# EAGLE design TransientsVCFG (EAGLE 9.6.2)
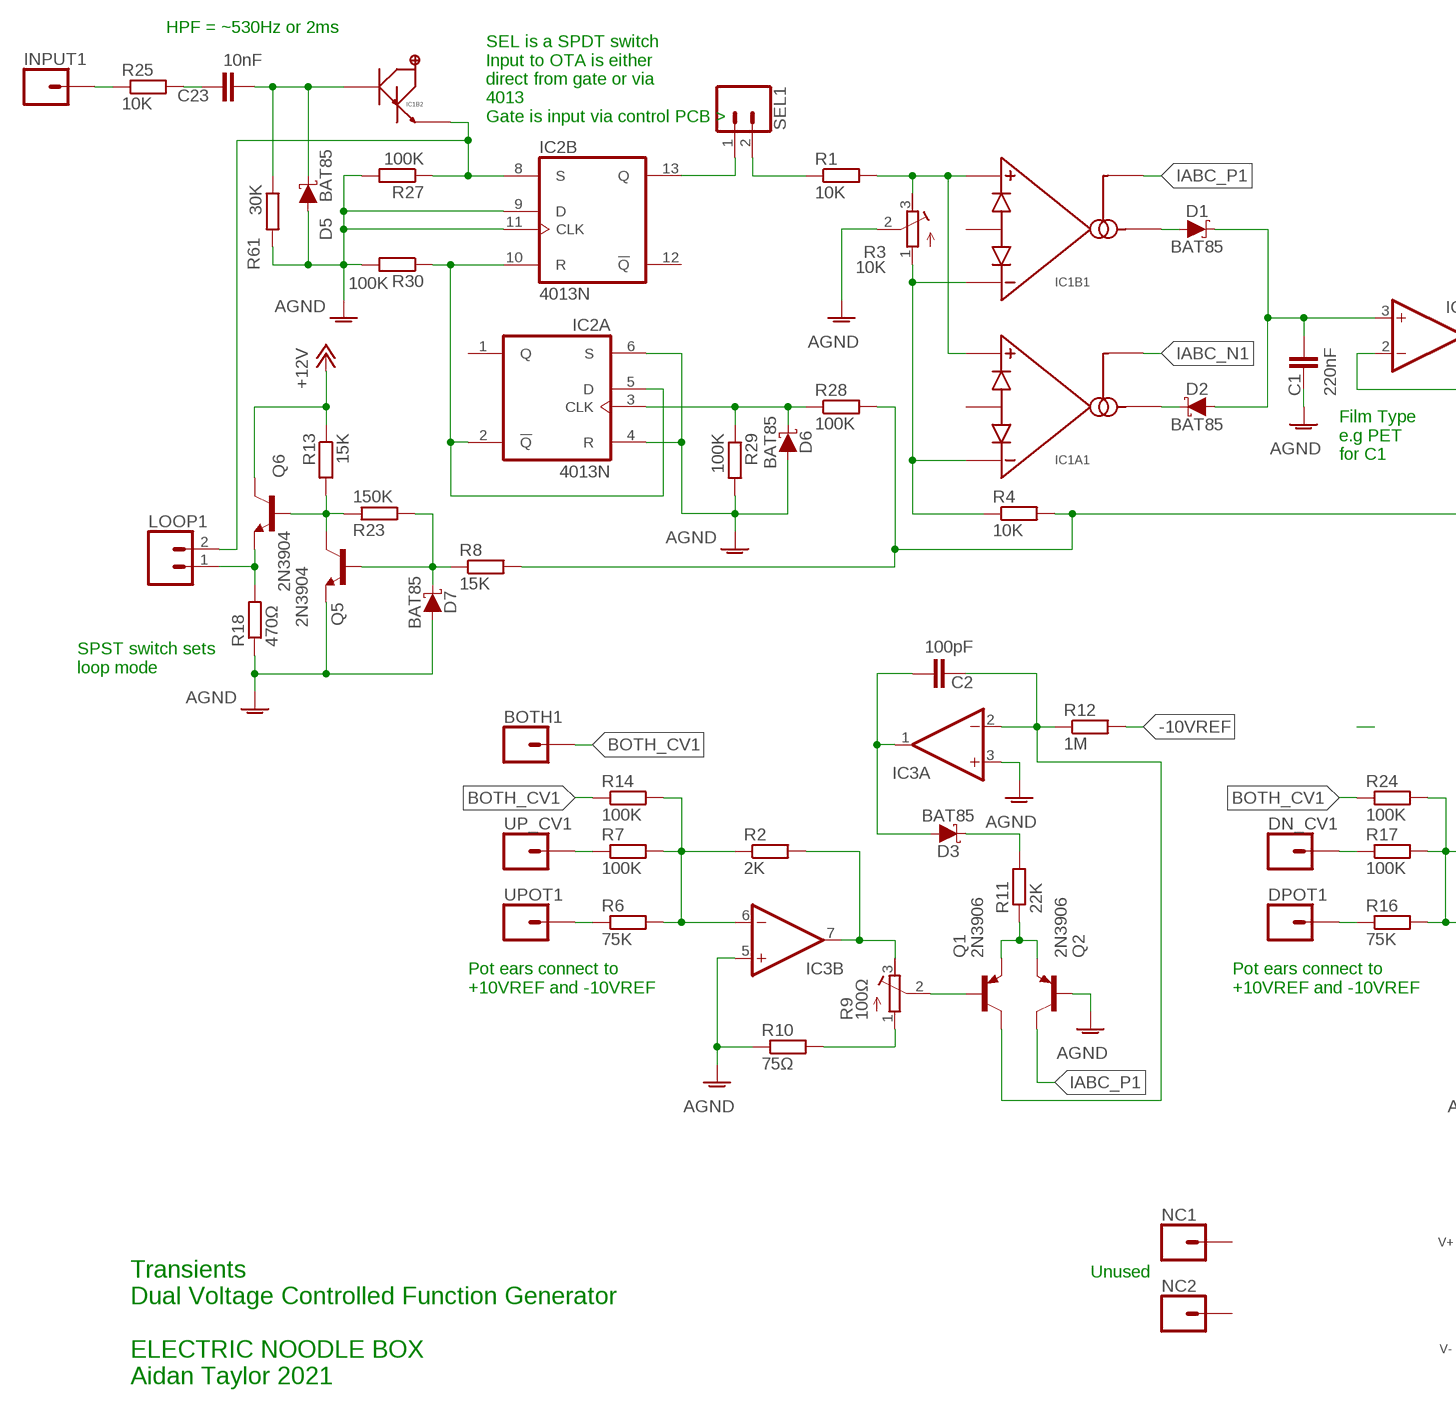
[diagram p0: schematic, sheet 1, part 1 of 2]
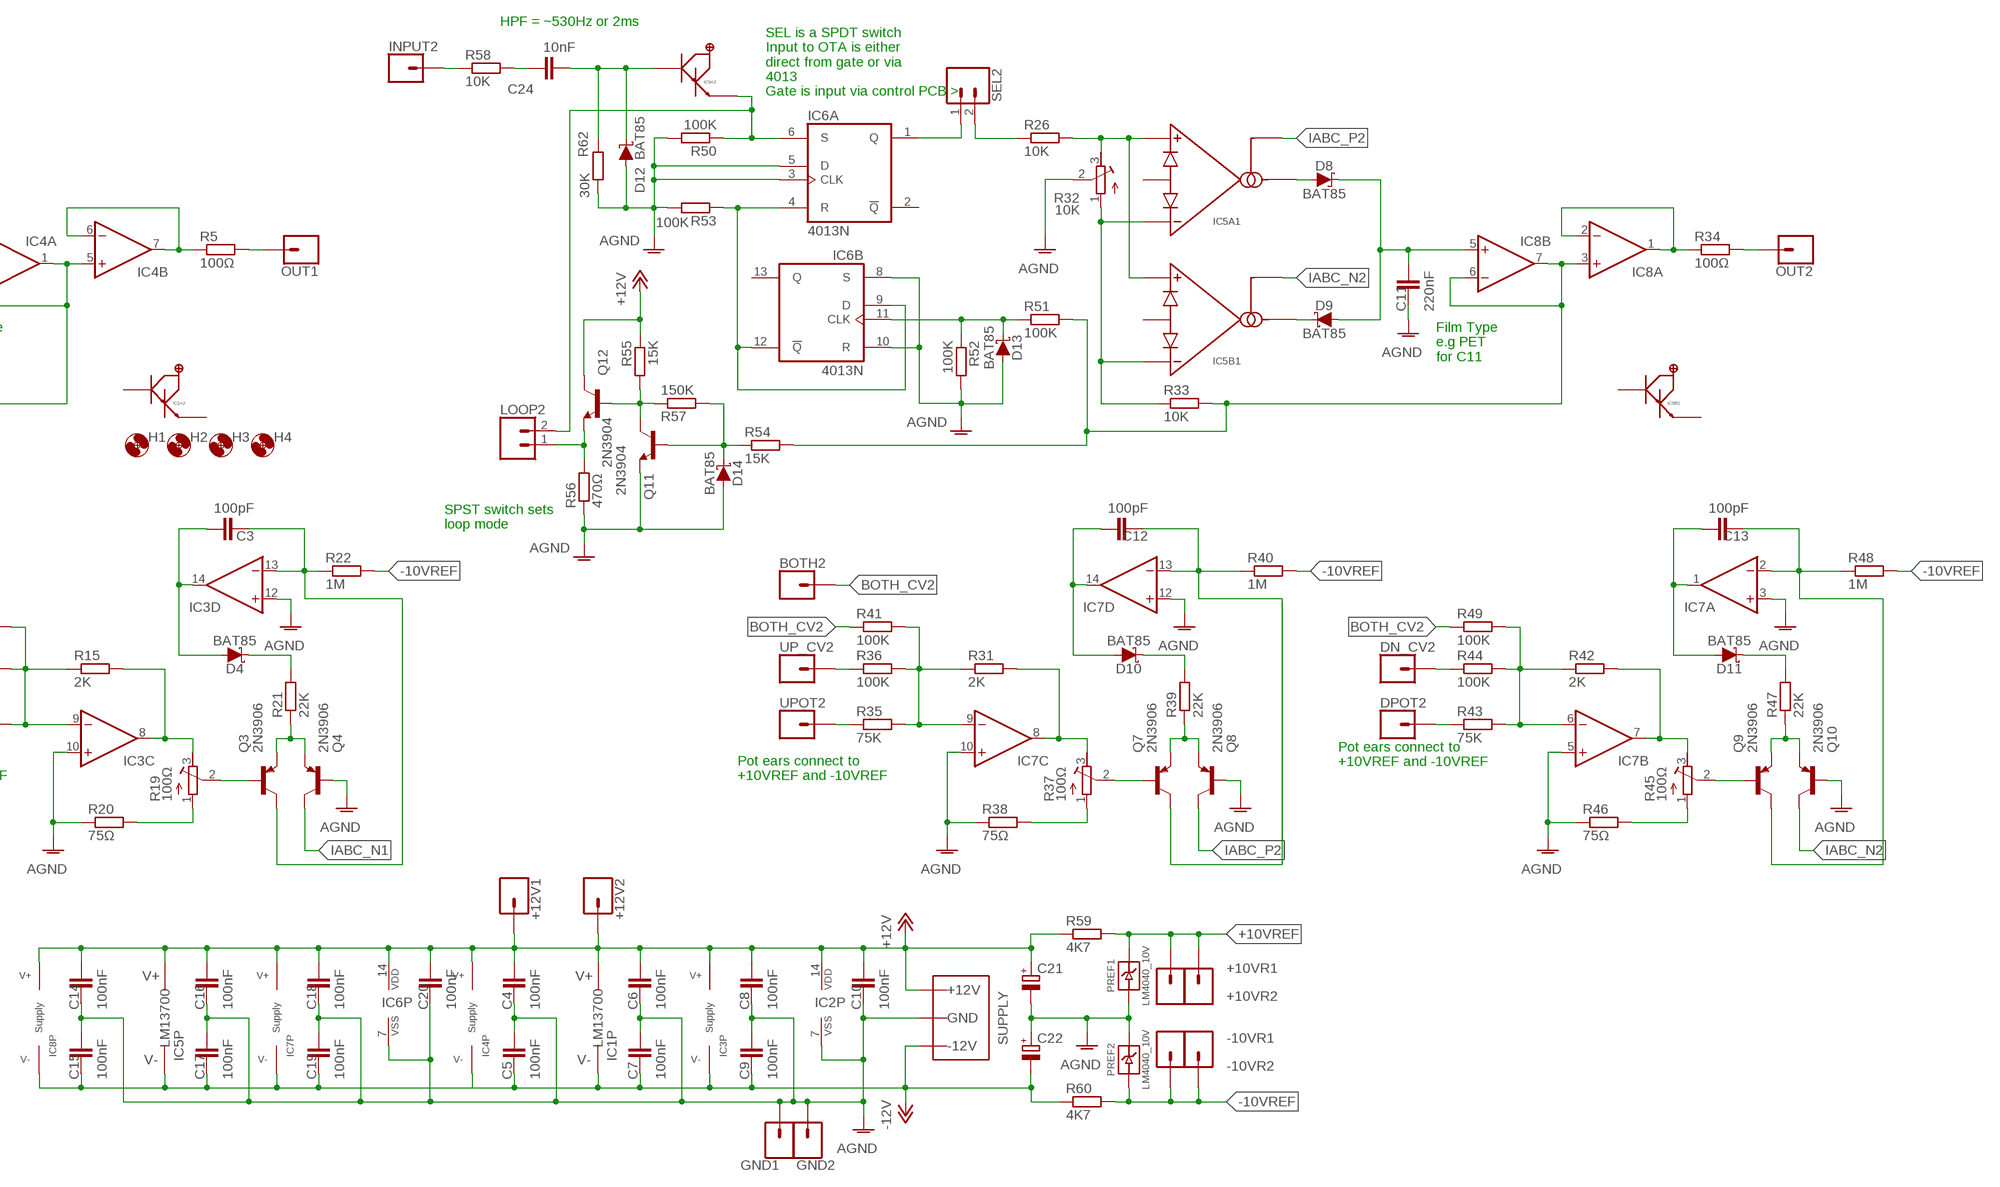
[diagram p1: schematic, sheet 1, part 2 of 2]

## Parts
+10VR1  1XWIREPAD  [1X01]
+10VR2  1XWIREPAD  [1X01]
+12V1  1XWIREPAD  [1X01]
+12V2  1XWIREPAD  [1X01]
-10VR1  1XWIREPAD  [1X01]
-10VR2  1XWIREPAD  [1X01]
BOTH1  1XWIREPAD  [1X01]
BOTH2  1XWIREPAD  [1X01]
C1  220nF  C-EU050-025X075  [C050-025X075]
C2  100pF  C-EU050-025X075  [C050-025X075]
C3  100pF  C-EU050-025X075  [C050-025X075]
C4  100nF  C-EU050-025X075  [C050-025X075]
C5  100nF  C-EU050-025X075  [C050-025X075]
C6  100nF  C-EU050-025X075  [C050-025X075]
C7  100nF  C-EU050-025X075  [C050-025X075]
C8  100nF  C-EU050-025X075  [C050-025X075]
C9  100nF  C-EU050-025X075  [C050-025X075]
C10  100nF  C-EU050-025X075  [C050-025X075]
C11  220nF  C-EU050-025X075  [C050-025X075]
C12  100pF  C-EU050-025X075  [C050-025X075]
C13  100pF  C-EU050-025X075  [C050-025X075]
C14  100nF  C-EU050-025X075  [C050-025X075]
C15  100nF  C-EU050-025X075  [C050-025X075]
C16  100nF  C-EU050-025X075  [C050-025X075]
C17  100nF  C-EU050-025X075  [C050-025X075]
C18  100nF  C-EU050-025X075  [C050-025X075]
C19  100nF  C-EU050-025X075  [C050-025X075]
C20  100nF  C-EU050-025X075  [C050-025X075]
C21  CPOL-EUE2.5-6  [E2,5-6]
C22  CPOL-EUE2.5-6  [E2,5-6]
C23  10nF  C-EU050-025X075  [C050-025X075]
C24  10nF  C-EU050-025X075  [C050-025X075]
D1  BAT85  SCHOTTKY_DO35  [DO35-7]
D2  BAT85  SCHOTTKY_DO35  [DO35-7]
D3  BAT85  SCHOTTKY_DO35  [DO35-7]
D4  BAT85  SCHOTTKY_DO35  [DO35-7]
D5  BAT85  SCHOTTKY_DO35  [DO35-7]
D6  BAT85  SCHOTTKY_DO35  [DO35-7]
D7  BAT85  SCHOTTKY_DO35  [DO35-7]
D8  BAT85  SCHOTTKY_DO35  [DO35-7]
D9  BAT85  SCHOTTKY_DO35  [DO35-7]
D10  BAT85  SCHOTTKY_DO35  [DO35-7]
D11  BAT85  SCHOTTKY_DO35  [DO35-7]
D12  BAT85  SCHOTTKY_DO35  [DO35-7]
D13  BAT85  SCHOTTKY_DO35  [DO35-7]
D14  BAT85  SCHOTTKY_DO35  [DO35-7]
DN_CV1  1XWIREPAD  [1X01]
DN_CV2  1XWIREPAD  [1X01]
DPOT1  1XWIREPAD  [1X01]
DPOT2  1XWIREPAD  [1X01]
GND1  1XWIREPAD  [1X01]
GND2  1XWIREPAD  [1X01]
H1  MOUNT-HOLE3.2  [3,2]
H2  MOUNT-HOLE3.2  [3,2]
H3  MOUNT-HOLE3.2  [3,2]
H4  MOUNT-HOLE3.2  [3,2]
IC1  LM13700DIL  [DIL16]
IC2  4013N  [DIL14]
IC3  TL0X4DIL  [DIL14]
IC4  TL0X2DIL  [DIL08]
IC5  LM13700DIL  [DIL16]
IC6  4013N  [DIL14]
IC7  TL0X4DIL  [DIL14]
IC8  TL0X2DIL  [DIL08]
INPUT1  1XWIREPAD  [1X01]
INPUT2  1XWIREPAD  [1X01]
LOOP1  2XWIREPAD  [1X02]
LOOP2  2XWIREPAD  [1X02]
NC1  1XWIREPAD  [1X01]
NC2  1XWIREPAD  [1X01]
OUT1  1XWIREPAD  [1X01]
OUT2  1XWIREPAD  [1X01]
PREF1  LM4040_10V  LM4040TH  [TO92]
PREF2  LM4040_10V  LM4040TH  [TO92]
Q1  2N3906  [TO92]
Q2  2N3906  [TO92]
Q3  2N3906  [TO92]
Q4  2N3906  [TO92]
Q5  2N3904  [TO92]
Q6  2N3904  [TO92]
Q7  2N3906  [TO92]
Q8  2N3906  [TO92]
Q9  2N3906  [TO92]
Q10  2N3906  [TO92]
Q11  2N3904  [TO92]
Q12  2N3904  [TO92]
R1  10K  R-EU_0207/10  [0207/10]
R2  2K  R-EU_0207/10  [0207/10]
R3  10K  R-TRIMM3296W  [RTRIM3296W]
R4  10K  R-EU_0207/10  [0207/10]
R5  100Ω  R-EU_0207/10  [0207/10]
R6  75K  R-EU_0207/10  [0207/10]
R7  100K  R-EU_0207/10  [0207/10]
R8  15K  R-EU_0207/10  [0207/10]
R9  100Ω  R-TRIMM3296W  [RTRIM3296W]
R10  75Ω  R-EU_0207/10  [0207/10]
R11  22K  R-EU_0207/10  [0207/10]
R12  1M  R-EU_0207/10  [0207/10]
R13  15K  R-EU_0207/10  [0207/10]
R14  100K  R-EU_0207/10  [0207/10]
R15  2K  R-EU_0207/10  [0207/10]
R16  75K  R-EU_0207/10  [0207/10]
R17  100K  R-EU_0207/10  [0207/10]
R18  470Ω  R-EU_0207/10  [0207/10]
R19  100Ω  R-TRIMM3296W  [RTRIM3296W]
R20  75Ω  R-EU_0207/10  [0207/10]
R21  22K  R-EU_0207/10  [0207/10]
R22  1M  R-EU_0207/10  [0207/10]
R23  150K  R-EU_0207/10  [0207/10]
R24  100K  R-EU_0207/10  [0207/10]
R25  10K  R-EU_0207/10  [0207/10]
R26  10K  R-EU_0207/10  [0207/10]
R27  100K  R-EU_0207/10  [0207/10]
R28  100K  R-EU_0207/10  [0207/10]
R29  100K  R-EU_0207/10  [0207/10]
R30  100K  R-EU_0207/10  [0207/10]
R31  2K  R-EU_0207/10  [0207/10]
R32  10K  R-TRIMM3296W  [RTRIM3296W]
R33  10K  R-EU_0207/10  [0207/10]
R34  100Ω  R-EU_0207/10  [0207/10]
R35  75K  R-EU_0207/10  [0207/10]
R36  100K  R-EU_0207/10  [0207/10]
R37  100Ω  R-TRIMM3296W  [RTRIM3296W]
R38  75Ω  R-EU_0207/10  [0207/10]
R39  22K  R-EU_0207/10  [0207/10]
R40  1M  R-EU_0207/10  [0207/10]
R41  100K  R-EU_0207/10  [0207/10]
R42  2K  R-EU_0207/10  [0207/10]
R43  75K  R-EU_0207/10  [0207/10]
R44  100K  R-EU_0207/10  [0207/10]
R45  100Ω  R-TRIMM3296W  [RTRIM3296W]
R46  75Ω  R-EU_0207/10  [0207/10]
R47  22K  R-EU_0207/10  [0207/10]
R48  1M  R-EU_0207/10  [0207/10]
R49  100K  R-EU_0207/10  [0207/10]
R50  100K  R-EU_0207/10  [0207/10]
R51  100K  R-EU_0207/10  [0207/10]
R52  100K  R-EU_0207/10  [0207/10]
R53  100K  R-EU_0207/10  [0207/10]
R54  15K  R-EU_0207/10  [0207/10]
R55  15K  R-EU_0207/10  [0207/10]
R56  470Ω  R-EU_0207/10  [0207/10]
R57  150K  R-EU_0207/10  [0207/10]
R58  10K  R-EU_0207/10  [0207/10]
R59  4K7  R-EU_0207/10  [0207/10]
R60  4K7  R-EU_0207/10  [0207/10]
R61  30K  R-EU_0207/10  [0207/10]
R62  30K  R-EU_0207/10  [0207/10]
SEL1  2XWIREPAD  [1X02]
SEL2  2XWIREPAD  [1X02]
UP_CV1  1XWIREPAD  [1X01]
UP_CV2  1XWIREPAD  [1X01]
UPOT1  1XWIREPAD  [1X01]
UPOT2  1XWIREPAD  [1X01]
WP1  COMBO_SUPPLY_HEADER  [COMBINED_POWER]

## Nets
+10VREF: +10VR1.1 +10VR2.1 PREF1.2(CATHODE) R59.2
+12V: +12V1.1 +12V2.1 C4.1 C6.1 C8.1 C10.1 C14.1 C16.1 C18.1 C20.1 C21.+ IC1.11(P:V+) IC2.14(P:VDD) IC3.4(P:V+) IC4.8(P:V+) IC5.11(P:V+) IC6.14(P:VDD) IC7.4(P:V+) IC8.8(P:V+) Q6.1(C) Q12.1(C) R13.1 R55.1 R59.1 WP1.V+1(V++) WP1.V+2(V++) WP1.V+3(V++)
-10VREF: -10VR1.1 -10VR2.1 PREF2.3(ANODE) R12.2 R22.2 R40.2 R48.2 R60.2
-12V: C5.2 C7.2 C9.2 C15.2 C17.2 C19.2 C22.- IC1.6(P:V-) IC3.11(P:V-) IC4.4(P:V-) IC5.6(P:V-) IC7.11(P:V-) IC8.4(P:V-) R60.1 WP1.V-1(V--) WP1.V-2(V--) WP1.V-3(V--)
AGND: C1.2 C4.2 C5.1 C6.2 C7.1 C8.2 C9.1 C10.2 C11.2 C14.2 C15.1 C16.2 C17.1 C18.2 C19.1 C20.2 C21.- C22.+ D5.A D6.A D7.A D12.A D13.A D14.A GND1.1 GND2.1 IC2.4(A:R) IC2.6(A:S) IC2.7(P:VSS) IC2.9(B:D) IC2.11(B:CLK) IC3.3(A:+IN) IC3.5(B:+IN) IC3.10(C:+IN) IC3.12(D:+IN) IC6.3(A:CLK) IC6.5(A:D) IC6.7(P:VSS) IC6.8(B:S) IC6.10(B:R) IC7.3(A:+IN) IC7.5(B:+IN) IC7.10(C:+IN) IC7.12(D:+IN) PREF1.3(ANODE) PREF2.2(CATHODE) Q2.2(B) Q4.2(B) Q5.3(E) Q8.2(B) Q10.2(B) Q11.3(E) R3.2(S) R10.1 R18.1 R20.1 R27.2 R29.2 R30.2 R32.2(S) R38.1 R46.1 R50.2 R52.2 R53.2 R56.1 R61.2 R62.2 WP1.GND1(AGND) WP1.GND2(AGND) WP1.GND3(AGND) WP1.GND4(AGND) WP1.GND5(AGND) WP1.GND6(AGND) WP1.GND7(AGND) WP1.GND8(AGND)
BOTH_CV1: BOTH1.1 R14.1 R24.1
BOTH_CV2: BOTH2.1 R41.1 R49.1
IABC_N1: IC1.1(A1:AMPBIAS) Q4.1(C)
IABC_N2: IC5.16(B1:AMPBIAS) Q10.1(C)
IABC_P1: IC1.16(B1:AMPBIAS) Q2.1(C)
IABC_P2: IC5.1(A1:AMPBIAS) Q8.1(C)
N$1: IC1.3(A1:AMP+) IC1.14(B1:AMP+) R1.2 R3.3(E)
N$2: D1.A IC1.12(B1:AMPOUT)
N$3: C1.1 D1.C D2.A IC4.3(A:+IN)
N$4: IC4.1(A:OUT) IC4.2(A:-IN) IC4.5(B:+IN) R4.2 R8.2 R28.2
N$5: D2.C IC1.5(A1:AMPOUT)
N$6: IC4.6(B:-IN) IC4.7(B:OUT) R5.1
N$7: IC1.4(A1:AMP-) IC1.13(B1:AMP-) R3.1(A) R4.1
N$8: IC3.6(B:-IN) R2.1 R6.2 R7.2 R14.2
N$9: IC3.7(B:OUT) R2.2 R9.3(E)
N$10: R9.1(A) R10.2
N$11: Q1.2(B) R9.2(S)
N$12: Q1.3(E) Q2.3(E) R11.1
N$13: C2.1 D3.A IC3.1(A:OUT)
N$14: C2.2 IC3.2(A:-IN) Q1.1(C) R12.1
N$15: D3.C R11.2
N$16: IC5.3(A1:AMP+) IC5.14(B1:AMP+) R26.2 R32.3(E)
N$17: C11.1 D8.C D9.A IC8.5(B:+IN)
N$18: R7.1 UP_CV1.1
N$19: OUT1.1 R5.2
N$20: IC3.9(C:-IN) R15.1 R16.2 R17.2 R24.2
N$21: R6.1 UPOT1.1
N$22: IC3.8(C:OUT) R15.2 R19.3(E)
N$23: R19.1(A) R20.2
N$24: Q3.2(B) R19.2(S)
N$25: Q3.3(E) Q4.3(E) R21.1
N$26: C3.1 D4.A IC3.14(D:OUT)
N$27: C3.2 IC3.13(D:-IN) Q3.1(C) R22.1
N$28: IC1.9(B2:BUFF_OUT) IC2.8(B:S) LOOP1.2 R27.1
N$29: D4.C R21.2
N$30: Q5.1(C) Q6.2(B) R13.2 R23.1
N$31: DN_CV1.1 R17.1
N$32: DPOT1.1 R16.1
N$33: R1.1 SEL1.2
N$34: IC2.13(B:Q) SEL1.1
N$35: IC8.3(A:+IN) IC8.6(B:-IN) IC8.7(B:OUT) R33.2 R51.2 R54.2
N$36: INPUT1.1 R25.1
N$37: IC2.2(A:!Q) IC2.5(A:D) IC2.10(B:R) R30.1
N$38: LOOP1.1 Q6.3(E) R18.2
N$39: D7.C Q5.2(B) R8.1 R23.2
N$40: C23.2 D5.C IC1.10(B2:BUFF_IN) R61.1
N$41: D6.C IC2.3(A:CLK) R28.1 R29.1
N$43: D8.A IC5.5(A1:AMPOUT)
N$44: D9.C IC5.12(B1:AMPOUT)
N$45: IC5.4(A1:AMP-) IC5.13(B1:AMP-) R32.1(A) R33.1
N$46: IC8.1(A:OUT) IC8.2(A:-IN) R34.1
N$47: IC7.9(C:-IN) R31.1 R35.2 R36.2 R41.2
N$48: IC7.8(C:OUT) R31.2 R37.3(E)
N$49: R37.1(A) R38.2
N$50: Q7.2(B) R37.2(S)
N$51: Q7.3(E) Q8.3(E) R39.1
N$52: C12.1 D10.A IC7.14(D:OUT)
N$53: C12.2 IC7.13(D:-IN) Q7.1(C) R40.1
N$54: R36.1 UP_CV2.1
N$55: R35.1 UPOT2.1
N$56: OUT2.1 R34.2
N$57: IC7.6(B:-IN) R42.1 R43.2 R44.2 R49.2
N$58: IC7.7(B:OUT) R42.2 R45.3(E)
N$59: R45.1(A) R46.2
N$60: Q9.2(B) R45.2(S)
N$61: Q9.3(E) Q10.3(E) R47.1
N$62: C13.1 D11.A IC7.1(A:OUT)
N$63: C13.2 IC7.2(A:-IN) Q9.1(C) R48.1
N$64: DN_CV2.1 R44.1
N$65: DPOT2.1 R43.1
N$66: IC6.4(A:R) IC6.9(B:D) IC6.12(B:!Q) R53.1
N$67: IC5.8(A2:BUFF_OUT) IC6.6(A:S) LOOP2.2 R50.1
N$68: R26.1 SEL2.2
N$69: IC6.1(A:Q) SEL2.1
N$70: D13.C IC6.11(B:CLK) R51.1 R52.1
N$71: C24.1 R58.2
N$72: D11.C R47.2
N$73: D10.C R39.2
N$74: Q11.1(C) Q12.2(B) R55.2 R57.1
N$75: LOOP2.1 Q12.3(E) R56.2
N$76: D14.C Q11.2(B) R54.1 R57.2
N$77: INPUT2.1 R58.1
N$79: C23.1 R25.2
N$80: C24.2 D12.C IC5.7(A2:BUFF_IN) R62.1
Unconnected: IC1.2(A1:DIODES) IC1.7(A2:BUFF_IN) IC1.8(A2:BUFF_OUT) IC1.15(B1:DIODES) IC2.1(A:Q) IC2.12(B:!Q) IC5.2(A1:DIODES) IC5.9(B2:BUFF_OUT) IC5.10(B2:BUFF_IN) IC5.15(B1:DIODES) IC6.2(A:!Q) IC6.13(B:Q) NC1.1 NC2.1

## Notes on the sheet
- HPF = ~530Hz or 2ms | HPF = ~530Hz or 2ms
- SEL is a SPDT switch
  Input to OTA is either 
  direct from gate or via
  4013
  Gate is input via control PCB >
- SEL is a SPDT switch
  Input to OTA is either 
  direct from gate or via
  4013
  Gate is input via control PCB >
- Film Type
  e.g PET
  for C1
- Film Type
  e.g PET
  for C11
- SPST switch sets
  loop mode
- SPST switch sets
  loop mode
- Pot ears connect to
  +10VREF and -10VREF
- Pot ears connect to
  +10VREF and -10VREF
- Pot ears connect to
  +10VREF and -10VREF
- Pot ears connect to
  +10VREF and -10VREF
- Unused
- Transients
  Dual Voltage Controlled Function Generator
  
  ELECTRIC NOODLE BOX
  Aidan Taylor 2021

## Library data of the parts
+10VR1 +10VR2 +12V1 +12V2 -10VR1 -10VR2 BOTH1 BOTH2 DN_CV1 DN_CV2 DPOT1 DPOT2 GND1 GND2 INPUT1 INPUT2 NC1 NC2 OUT1 OUT2 UP_CV1 UP_CV2 UPOT1 UPOT2 = ElectricNoodleBox:1XWIREPAD
C1-C20 C23 C24 = rcl:C-EU: CAPACITOR, European symbol; SPICEPREFIX: C
C21 C22 = rcl:CPOL-EU: POLARIZED CAPACITOR, European symbol; SPICEPREFIX: C
D1-D14 = ElectricNoodleBox:SCHOTTKY_DO35
H1-H4 = holes:MOUNT-HOLE: MOUNTING HOLE with drill center marker
IC1 IC5 = ElectricNoodleBox:LM13700: Dual Transconductance Amplifier with Darlington Buffer; CATALOGUE: 3118206; RETAILER: Farnell
IC2 IC6 = 40xx:4013: Dual D FLIP FLOP, set/reset
IC3 IC7 = ElectricNoodleBox:TL0X4: Quad Operational Amplifier; CATALOGUE: 3005140; RETAILER: Farnell
IC4 IC8 = ElectricNoodleBox:TL0X2: Dual Operational Amplifier; CATALOGUE: 1103189; RETAILER: Farnell
LOOP1 LOOP2 SEL1 SEL2 = ElectricNoodleBox:2XWIREPAD
PREF1 PREF2 = ElectricNoodleBox:LM4040
Q1-Q4 Q7-Q10 = transistor-pnp:2N3906: PNP Transistor
Q5 Q6 Q11 Q12 = transistor-npn:2N3904: NPN Transistor
R1 R2 R4-R8 R10-R18 R20-R31 R33-R36 R38-R44 R46-R62 = rcl:R-EU_: RESISTOR, European symbol; SPICEPREFIX: R
R3 R9 R19 R32 R37 R45 = rcl:R-TRIMM: Trimm resistor; SPICEMODEL: X; SPICEPREFIXL: POT
WP1 = ElectricNoodleBox:COMBO_SUPPLY_HEADER

## Board
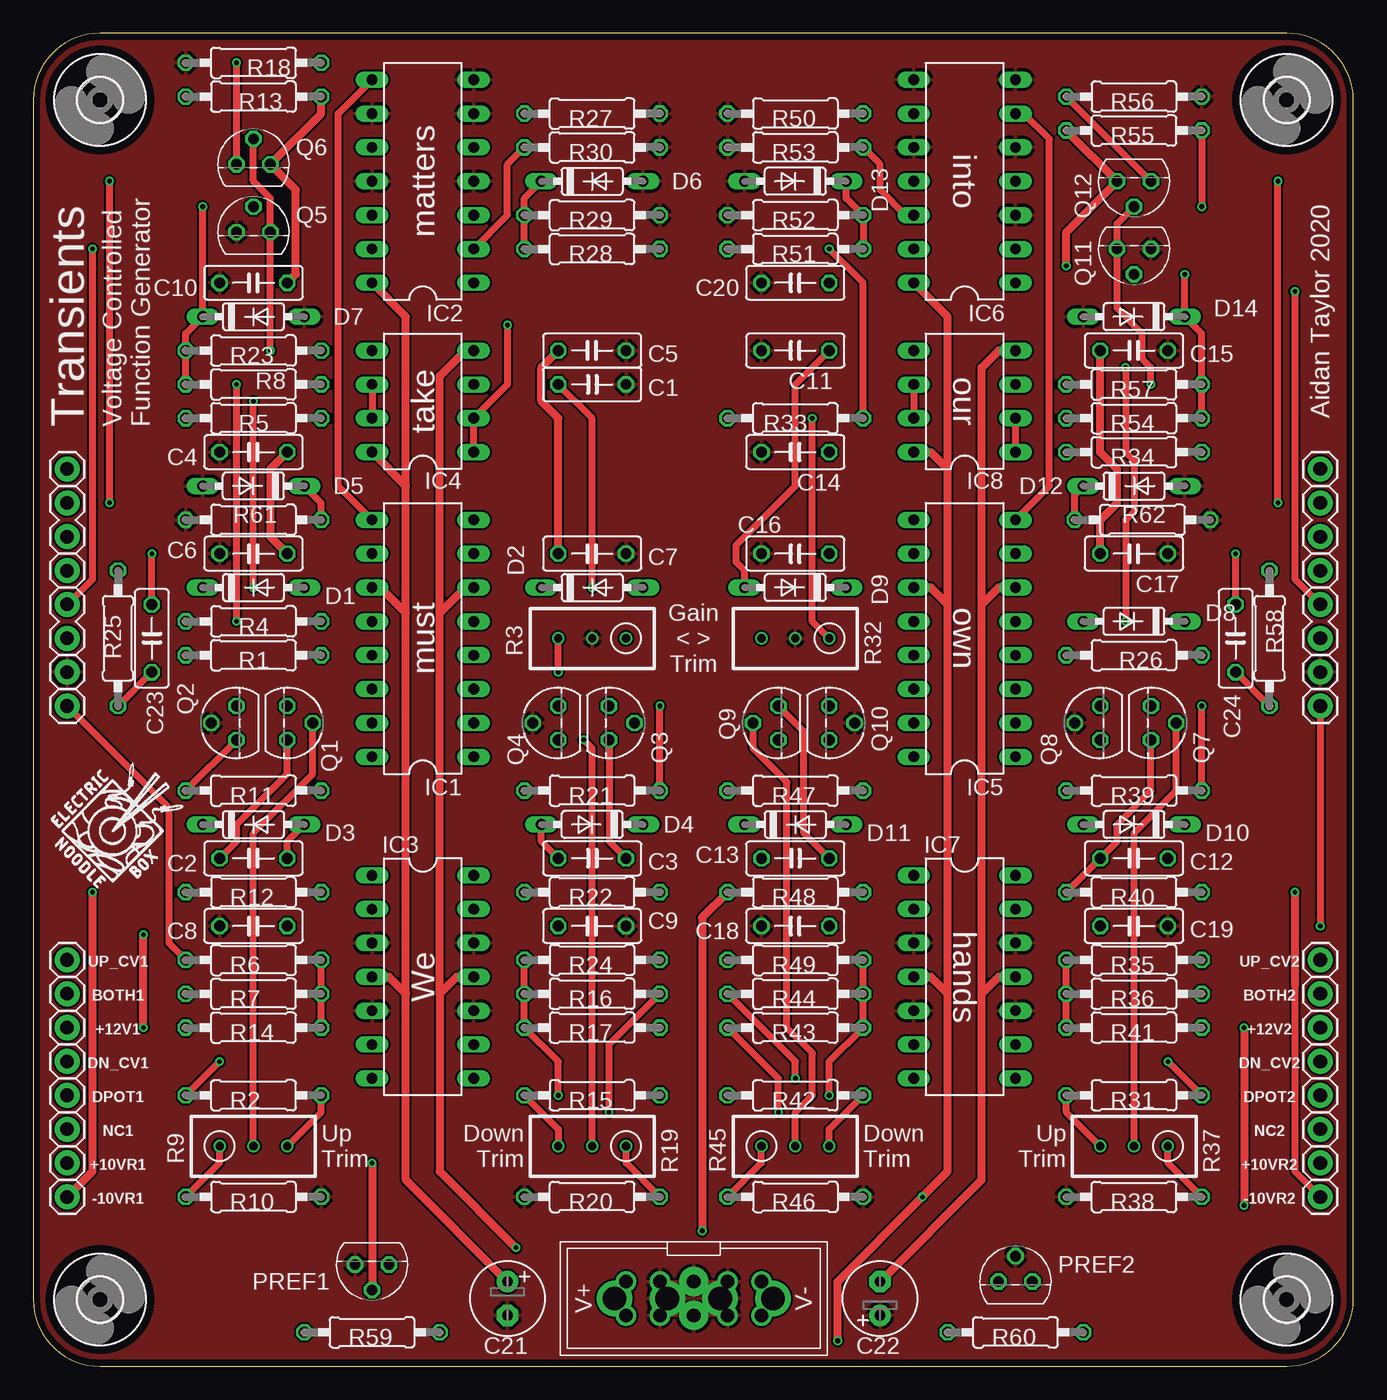
[diagram p2: board, top side]
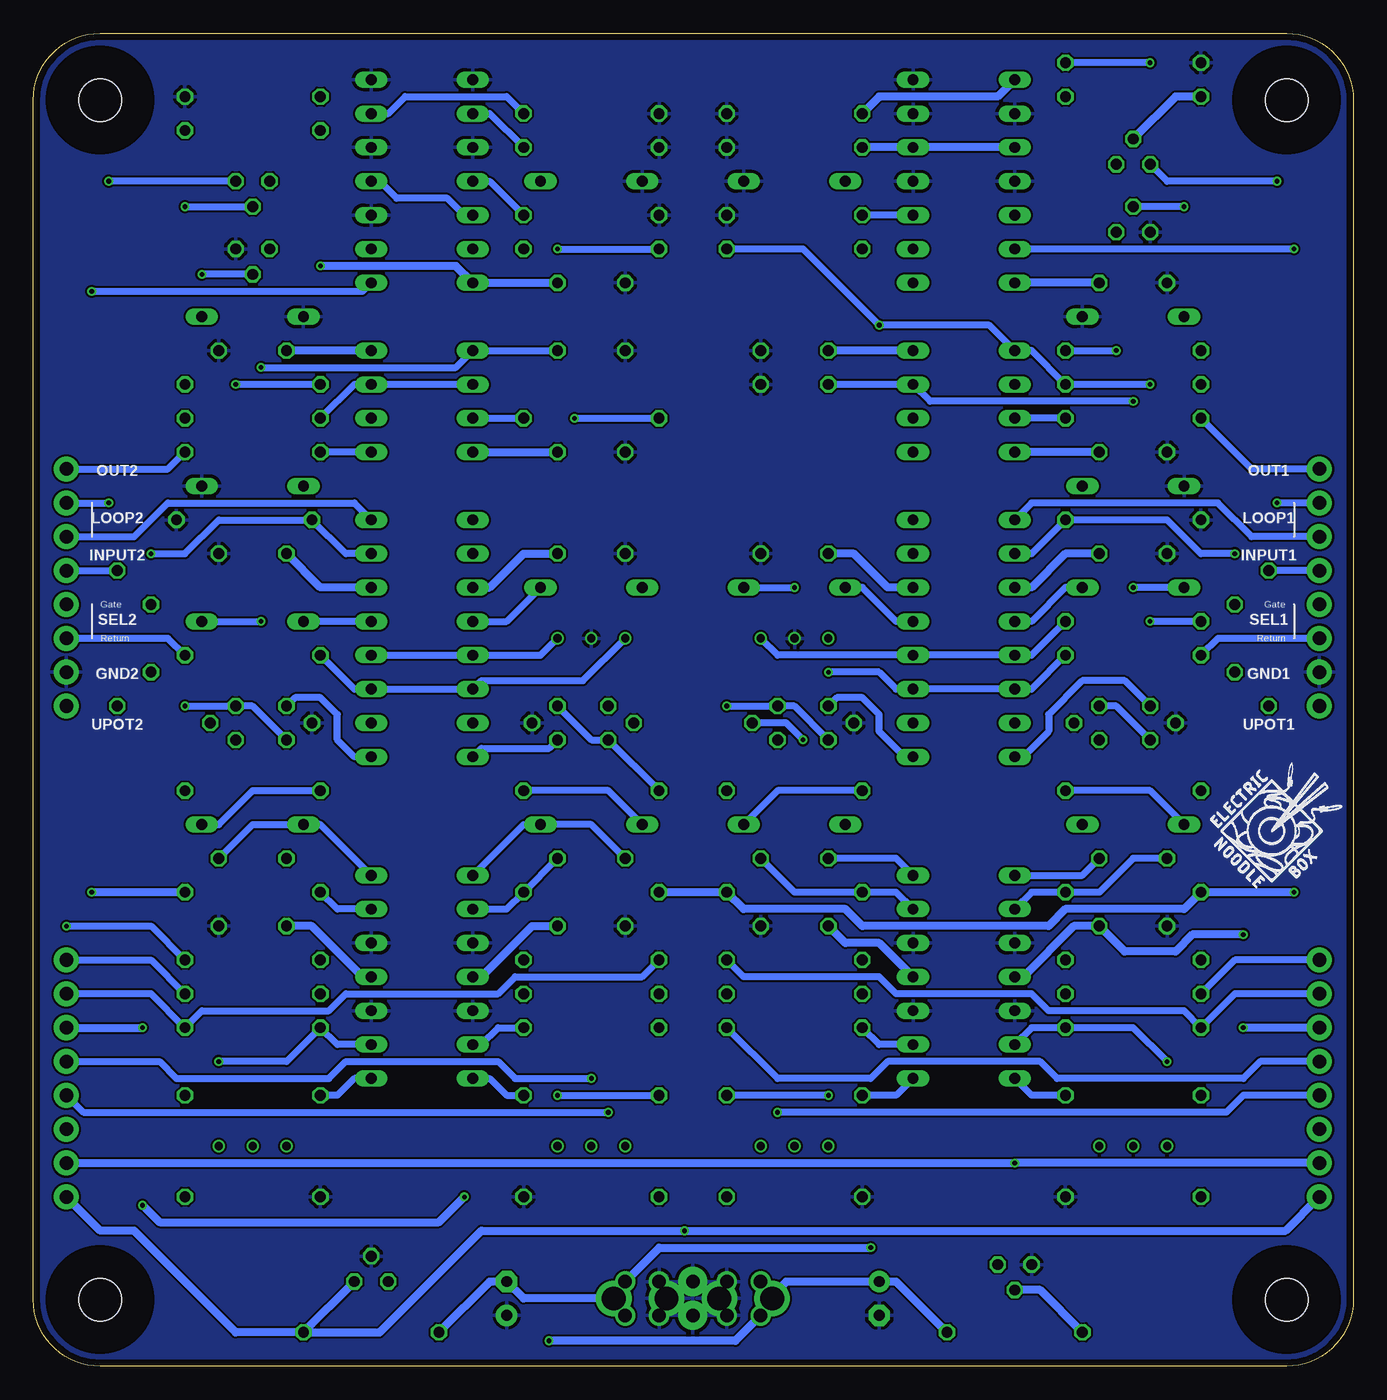
[diagram p3: board, bottom side, seen from below]

Size 99 x 100 mm. Coordinates in mm from the lower left corner, seen from the top.
Outline: 0,95 0,5 arc90 5,0 94,0 arc90 99,5 99,95 arc90 94,100 5,100 arc90 0,95
Copper layers (1*16): Top 0.035mm / dielectric 1.6mm / Bottom 0.035mm
Design rules "Elecrow_2-layer_PCB_eagle_rule": minimum track width 6mil, minimum drill 12mil, track to track 6mil, track to pad 6mil, pad to pad 6mil, via to via 8mil, smd to smd 0mil, copper to edge 20mil, drill to drill 10mil, minimum pad ring 6mil, minimum via ring 6mil, stop-mask expansion 0mil, vias tented up to drill 100mil, thermal gap 10mil

### Footprints (pad centres in the part's own frame; a part is rotated, then mirrored left to right if it is on the bottom)
1X01 = drill 1.016 pad 1.88: 1 0,0
C050-025X075 = drill 0.813 octagon: 1 -2.54,0; 2 2.54,0
E2,5-6 = drill 0.813 pad 1.6: + -1.27,0 | drill 0.813 pad 1.6 octagon: - 1.27,0
DO35-7 = drill 0.813 long: A 3.81,0; C -3.81,0
3,2 = hole 3.2: 0,0
DIL16 = drill 0.813 long: 1 -8.89,-3.81; 2 -6.35,-3.81; 3 -3.81,-3.81; 4 -1.27,-3.81; 5 1.27,-3.81; 6 3.81,-3.81; 7 6.35,-3.81; 8 8.89,-3.81; 9 8.89,3.81; 10 6.35,3.81; 11 3.81,3.81; 12 1.27,3.81; 13 -1.27,3.81; 14 -3.81,3.81; 15 -6.35,3.81; 16 -8.89,3.81
DIL14 = drill 0.813 long: 1 -7.62,-3.81; 2 -5.08,-3.81; 3 -2.54,-3.81; 4 0,-3.81; 5 2.54,-3.81; 6 5.08,-3.81; 7 7.62,-3.81; 8 7.62,3.81; 9 5.08,3.81; 10 2.54,3.81; 11 0,3.81; 12 -2.54,3.81; 13 -5.08,3.81; 14 -7.62,3.81
DIL08 = drill 0.813 long: 1 -3.81,-3.81; 2 -1.27,-3.81; 3 1.27,-3.81; 4 3.81,-3.81; 5 3.81,3.81; 6 1.27,3.81; 7 -1.27,3.81; 8 -3.81,3.81
1X02 = drill 1.016 pad 1.88: 1 0,0; 2 2.54,0
TO92 = drill 0.813 octagon: 1 -1.27,0; 2 0,1.905; 3 1.27,0
TO92' = drill 0.813 octagon: 1 1.27,0; 2 0,1.905; 3 -1.27,0
0207/10 = drill 0.813 octagon: 1 -5.08,0; 2 5.08,0
RTRIM3296W = drill 0.61: 1 0,-2.54; 2 0,0; 3 0,2.54
COMBINED_POWER = drill 1.78: GND1 -1.98,0; GND2 1.98,0; V+1 -5.94,0; V-1 5.94,0 | drill 1.016: GND3 -2.54,1.27; GND5 2.54,1.27; GND6 -2.54,-1.27; GND8 2.54,-1.27; V+2 -5.08,1.27; V+3 -5.08,-1.27; V-2 5.08,1.27; V-3 5.08,-1.27 | drill 1.016 pad 2.184: GND4 0,1.27; GND7 0,-1.27

### Placement (x,y rotation side)
+10VR1  2.54,15.24 0 top
+10VR2  96.52,15.24 0 top
+12V1  2.54,25.4 0 top
+12V2  96.52,25.4 0 top
-10VR1  2.54,12.7 0 top
-10VR2  96.52,12.7 0 top
BOTH1  2.54,27.94 0 top
BOTH2  96.52,27.94 0 top
C1  41.91,73.66 0 top
C2  16.51,38.1 180 top
C3  41.91,38.1 0 top
C4  16.51,68.58 180 top
C5  41.91,76.2 180 top
C6  16.51,60.96 180 top
C7  41.91,60.96 180 top
C8  16.51,33.02 180 top
C9  41.91,33.02 180 top
C10  16.51,81.28 180 top
C11  57.15,76.2 180 top
C12  82.55,38.1 180 top
C13  57.15,38.1 0 top
C14  57.15,68.58 180 top
C15  82.55,76.2 180 top
C16  57.15,60.96 180 top
C17  82.55,60.96 180 top
C18  57.15,33.02 180 top
C19  82.55,33.02 180 top
C20  57.15,81.28 180 top
C21  35.56,5.08 270 top
C22  63.5,5.08 90 top
C23  8.89,54.61 90 top
C24  90.17,54.61 90 top
D1  16.51,58.42 0 top
D2  41.91,58.42 0 top
D3  16.51,40.64 0 top
D4  41.91,40.64 180 top
D5  16.51,66.04 180 top
D6  41.91,88.9 0 top
D7  16.51,78.74 0 top
D8  82.55,55.88 180 top
D9  57.15,58.42 180 top
D10  82.55,40.64 180 top
D11  57.15,40.64 0 top
D12  82.55,66.04 0 top
D13  57.15,88.9 180 top
D14  82.55,78.74 180 top
DN_CV1  2.54,22.86 0 top
DN_CV2  96.52,22.86 0 top
DPOT1  2.54,20.32 0 top
DPOT2  96.52,20.32 0 top
GND1  2.54,52.07 0 top
GND2  96.52,52.07 0 top
H1  5,5 0 top
H2  94,5 0 top
H3  5,95 0 top
H4  94,95 0 top
IC1  29.21,54.61 90 top
IC2  29.21,88.9 90 top
IC3  29.21,29.21 270 top
IC4  29.21,72.39 90 top
IC5  69.85,54.61 90 top
IC6  69.85,88.9 90 top
IC7  69.85,29.21 270 top
IC8  69.85,72.39 90 top
INPUT1  2.54,59.69 0 top
INPUT2  96.52,59.69 0 top
LOOP1  2.54,64.77 270 top
LOOP2  96.52,64.77 270 top
NC1  2.54,17.78 0 top
NC2  96.52,17.78 0 top
OUT1  2.54,67.31 0 top
OUT2  96.52,67.31 0 top
PREF1  25.4,7.62 180 top
PREF2  73.66,6.35 0 top
Q1  2N3906  [TO92']  19.05,48.26 270 top
Q2  2N3906  [TO92']  15.24,48.26 90 top
Q3  2N3906  [TO92']  43.18,48.26 270 top
Q4  2N3906  [TO92']  39.37,48.26 90 top
Q5  2N3904  [TO92']  16.51,85.09 0 top
Q6  2N3904  [TO92']  16.51,90.17 0 top
Q7  2N3906  [TO92']  83.82,48.26 270 top
Q8  2N3906  [TO92']  80.01,48.26 90 top
Q9  2N3906  [TO92']  55.88,48.26 90 top
Q10  2N3906  [TO92']  59.69,48.26 270 top
Q11  2N3904  [TO92']  82.55,83.82 180 top
Q12  2N3904  [TO92']  82.55,88.9 180 top
R1  16.51,53.34 0 top
R2  16.51,20.32 0 top
R3  41.91,54.61 90 top
R4  16.51,55.88 180 top
R5  16.51,71.12 180 top
R6  16.51,30.48 0 top
R7  16.51,27.94 0 top
R8  16.51,73.66 0 top
R9  16.51,16.51 270 top
R10  16.51,12.7 180 top
R11  16.51,43.18 0 top
R12  16.51,35.56 180 top
R13  16.51,95.25 180 top
R14  16.51,25.4 0 top
R15  41.91,20.32 180 top
R16  41.91,27.94 180 top
R17  41.91,25.4 180 top
R18  16.51,97.79 0 top
R19  41.91,16.51 90 top
R20  41.91,12.7 0 top
R21  41.91,43.18 180 top
R22  41.91,35.56 0 top
R23  16.51,76.2 180 top
R24  41.91,30.48 180 top
R25  6.35,54.61 270 top
R26  82.55,53.34 180 top
R27  41.91,93.98 0 top
R28  41.91,83.82 0 top
R29  41.91,86.36 0 top
R30  41.91,91.44 0 top
R31  82.55,20.32 180 top
R32  57.15,54.61 90 top
R33  57.15,71.12 0 top
R34  82.55,68.58 0 top
R35  82.55,30.48 180 top
R36  82.55,27.94 180 top
R37  82.55,16.51 90 top
R38  82.55,12.7 0 top
R39  82.55,43.18 180 top
R40  82.55,35.56 0 top
R41  82.55,25.4 180 top
R42  57.15,20.32 0 top
R43  57.15,25.4 0 top
R44  57.15,27.94 0 top
R45  57.15,16.51 270 top
R46  57.15,12.7 180 top
R47  57.15,43.18 0 top
R48  57.15,35.56 180 top
R49  57.15,30.48 0 top
R50  57.15,93.98 180 top
R51  57.15,83.82 180 top
R52  57.15,86.36 180 top
R53  57.15,91.44 180 top
R54  82.55,71.12 180 top
R55  82.55,92.71 0 top
R56  82.55,95.25 180 top
R57  82.55,73.66 0 top
R58  92.71,54.61 270 top
R59  25.4,2.54 180 top
R60  73.66,2.54 0 top
R61  16.51,63.5 180 top
R62  83.19,63.5 0 top
SEL1  2.54,57.15 270 top
SEL2  96.52,57.15 270 top
U$1  [LOGO10X10]  1.27,35.56 0 top
U$2  [LOGO10X10]  10.79,35.56 0 bottom
UP_CV1  2.54,30.48 0 top
UP_CV2  96.52,30.48 0 top
UPOT1  2.54,49.53 0 top
UPOT2  96.52,49.53 0 top
WP1  49.53,5.08 0 top

### Tracks (layer width: path | path; a pad name or v marks a point on that pad's centre or on a via)
+10VREF  (via drill 0.35)
  Top 0.61: v25.4,15.24 PREF1.2
  Bottom 0.61: +10VR1.1 v25.4,15.24 +10VR2.1 | R59.2 23.5,5.71 PREF1.2
+12V  (via drill 0.35)
  Top 0.61: C4.1 17.78,67.31 17.78,62.23 C6.1 | C10.1 19.68,81.92 19.68,88.27 Q6.1 21.59,93.98 R13.1 | IC2.14 27.94,78.74 27.94,66.04 | 27.94,27.94 27.94,56.52 | 27.94,56.52 27.94,66.04 | IC4.8 27.94,66.04 | IC1.11 26.04,58.42 27.94,56.52 | C21.+ 27.94,13.97 27.94,27.94 | 27.94,27.94 26.67,29.21 IC3.4 | R55.1 Q12.1 77.47,85.09 v77.47,82.55 | v60.33,1.91 60.33,6.35 v66.67,12.7 68.58,14.61 68.58,27.94 | IC6.14 68.58,78.74 68.58,67.31 | 68.58,27.94 68.58,57.15 | 68.58,57.15 68.58,67.31 | IC8.8 67.31,68.58 68.58,67.31 | 68.58,57.15 67.31,58.42 IC5.11 | IC7.4 67.31,29.21 68.58,27.94 | v90.81,25.4 v90.81,12.06 | v8.26,25.4 v8.26,32.38
  Bottom 0.61: IC3.4 24.77,29.21 20.95,33.02 C8.1 17.14,31.11 13.34,31.11 12.06,32.38 v8.26,32.38 | IC1.11 24.13,58.42 21.59,60.96 C6.1 | C4.1 IC4.8 | C10.1 IC2.14 | R59.1 34.29,6.35 C21.+ 42.55,6.35 43.59,5.3 | 43.59,5.3 WP1.V+1 44.45,4.22 WP1.V+3 46.35,1.91 v60.33,1.91 | WP1.V+2 44.45,6.17 43.59,5.3 | v77.47,82.55 67.31,82.55 IC6.14 C20.1 | IC7.4 65.41,29.21 61.59,33.02 C18.1 | IC5.11 64.77,58.42 62.23,60.96 C16.1 | IC8.8 C14.1 | +12V2.1 v90.81,25.4 | v90.81,12.06 89.53,10.79 68.58,10.79 v66.67,12.7 | +12V1.1 7.62,25.4 v8.26,25.4
-10VREF  (via drill 0.35)
  Top 0.508: -10VR2.1 94.61,14.61 94.61,28.57
  Top 0.61: -10VR1.1 4.45,14.61 v4.45,35.56 | R48.2 50.16,33.66 v50.16,10.16 | v94.61,35.56 94.61,28.57
  Bottom 0.61: v4.45,35.56 R12.2 12.7,34.29 21.59,34.29 22.86,33.02 36.83,33.02 38.1,34.29 45.72,34.29 R22.2 R48.2 | R60.2 PREF2.3 | R60.2 73.03,2.54 65.41,10.16 v50.16,10.16 5.08,10.16 -10VR1.1 | R60.2 83.82,2.54 91.44,10.16 93.98,10.16 -10VR2.1 | R40.2 v94.61,35.56
-12V  (via drill 0.35)
  Top 0.61: C7.2 39.37,71.12 38.1,72.39 38.1,74.93 C5.2 | 30.48,27.94 30.48,14.61 v36.2,8.89 | 30.48,27.94 30.48,56.52 | 30.48,56.52 30.48,74.3 32.38,76.2 IC4.4 | IC1.6 32.38,58.42 30.48,56.52 | 30.48,27.94 31.75,29.21 IC3.11 | C17.2 80.01,63.5 81.28,64.77 81.28,67.31 80.01,68.58 C15.2 | C22.- 71.12,13.97 71.12,27.94 | IC8.4 72.39,76.2 71.12,74.93 71.12,57.15 | 71.12,27.94 71.12,57.15 | IC7.11 72.39,29.21 71.12,27.94 | IC5.6 72.39,58.42 71.12,57.15
  Bottom 0.61: IC3.11 35.56,31.75 38.1,31.75 C9.2 | C7.2 37.47,60.96 34.92,58.42 IC1.6 | IC4.4 C5.2 | WP1.V-1 54.61,5.94 WP1.V-2 52.07,8.89 v36.2,8.89 | WP1.V-1 62.23,5.08 C22.- 64.77,6.35 R60.1 | IC7.11 74.3,29.21 78.11,33.02 C19.2 | C17.2 77.47,58.42 IC5.6 | IC8.4 C15.2 | WP1.V-1 54.61,4.22 WP1.V-3
AGND
  pour Bottom: 0,0 99.06,0 99.06,100.33 0,100.33
  pour Top: 0,0 99.06,0 99.06,100.33 0,100.33
BOTH_CV1
  Bottom 0.508: BOTH1.1 8.89,27.94 R14.1 12.7,26.67 22.86,26.67 24.13,27.94 34.29,27.94 35.56,29.21 45.72,29.21 R24.1
BOTH_CV2
  Bottom 0.508: BOTH2.1 90.17,27.94 R41.1 86.36,26.67 76.83,26.67 75.56,27.94 64.14,27.94 62.87,29.21 53.34,29.21 R49.1
IABC_N1
  Bottom 0.508: IC1.1 33.66,45.72 35.56,47.62 35.56,48.9 36.83,50.16 38.73,50.16 Q4.1
IABC_N2
  Bottom 0.508: Q10.1 60.33,46.35 65.41,46.35 IC5.16
IABC_P1
  Bottom 0.508: Q2.1 17.14,51.44 20.32,51.44 22.86,48.9 22.86,47.62 24.77,45.72 IC1.16
IABC_P2
  Bottom 0.508: IC5.1 74.93,45.72 76.2,46.99 76.2,48.9 77.47,50.16 79.38,50.16 Q8.1
N$1  (via drill 0.35)
  Top 0.508: v39.37,52.07 R3.3
  Bottom 0.508: R1.2 24.13,50.8 IC1.14 IC1.3 34.29,50.8 35.56,52.07 v39.37,52.07
N$2
  Bottom 0.508: D1.A 21.59,58.42 24.13,55.88 IC1.12
N$3  (via drill 0.35)
  Top 0.508: v16.51,58.42 v16.51,72.39 | C1.1 41.91,71.12 v41.91,58.42
  Bottom 0.508: D1.C v16.51,58.42 | v16.51,72.39 31.75,72.39 IC4.3 C1.1 | D2.A v41.91,58.42
N$4  (via drill 0.35)
  Top 0.508: v15.24,55.88 v15.24,73.66 | v35.56,78.11 35.56,73.66 IC4.2 IC4.1
  Bottom 0.508: R4.2 v15.24,55.88 | v15.24,73.66 R8.2 24.13,76.2 IC4.5 27.3,78.11 v35.56,78.11 41.27,83.82 R28.2
N$5
  Bottom 0.508: D2.C 36.83,58.42 34.29,55.88 IC1.5
N$6
  Top 0.508: IC4.6 IC4.7
  Bottom 0.508: R5.1 IC4.7
N$7
  Bottom 0.508: R4.1 24.13,53.34 IC1.13 IC1.4 43.18,53.34 R3.1
N$8  (via drill 0.35)
  Top 0.508: R2.1 v13.97,22.86 | R14.2 R7.2 R6.2
  Bottom 0.508: IC3.6 24.13,25.4 R14.2 16.51,25.4 v13.97,22.86
N$9
  Top 0.508: R9.3 21.59,19.05 R2.2
  Bottom 0.508: IC3.7 24.13,20.32 R2.2
N$10
  Top 0.508: R10.2 13.97,15.24 R9.1
N$11
  Top 0.508: Q1.2 20.95,44.45 16.51,40.01 R9.2
N$12
  Top 0.508: R11.1 Q2.3
  Bottom 0.508: Q2.3 17.78,49.53 Q1.3
N$13
  Top 0.508: C2.1 19.05,39.37 D3.A
  Bottom 0.508: IC3.1 20.32,36.83 C2.1
N$14
  Top 0.508: C2.2 15.24,39.37 15.24,40.64 19.05,44.45 Q1.1
  Bottom 0.508: IC3.2 24.13,35.56 R12.1 19.05,35.56 16.51,38.1 C2.2
N$15
  Bottom 0.508: D3.C 15.24,43.18 R11.2
N$16
  Bottom 0.508: R26.2 74.93,50.8 IC5.3 IC5.14 65.41,51.44 57.78,51.44 R32.3
N$17  (via drill 0.35)
  Top 0.508: v81.92,55.88 81.92,63.5 82.55,64.14 82.55,67.94 81.92,68.58 v81.92,74.93 | D9.A 53.34,59.69 52.7,60.33 52.7,61.59 57.15,66.04 57.15,73.66 C11.1
  Bottom 0.508: D8.C v81.92,55.88 | v81.92,74.93 67.31,74.93 IC8.5 C11.1
N$18
  Bottom 0.508: UP_CV1.1 8.89,30.48 R7.1
N$19
  Bottom 0.508: R5.2 7.62,67.31 OUT1.1
N$20  (via drill 0.35)
  Top 0.508: R24.2 R16.2 R17.2 39.37,22.86 v39.37,20.32
  Bottom 0.508: IC3.9 35.56,24.13 R17.2 | v39.37,20.32 R15.1
N$21
  Top 0.508: UPOT1.1 10.16,41.91 10.16,31.75 R6.1
N$22
  Top 0.508: R15.2 39.37,17.78 R19.3
  Bottom 0.508: IC3.8 34.29,20.32 R15.2
N$23
  Top 0.508: R20.2 44.45,15.24 R19.1
N$24  (via drill 0.35)
  Top 0.508: v41.27,46.99 41.91,46.35 R19.2
  Bottom 0.508: v41.27,46.99 42.55,48.26 Q3.2
N$25  (via drill 0.35)
  Top 0.508: R21.1 v46.99,49.53
  Bottom 0.508: Q4.3 41.91,49.53 Q3.3 v46.99,49.53
N$26
  Top 0.508: C3.1 38.1,39.37 D4.A
  Bottom 0.508: IC3.14 34.29,38.1 C3.1
N$27
  Top 0.508: C3.2 43.18,39.37 Q3.1
  Bottom 0.508: C3.2 41.91,35.56 R22.1 34.29,35.56 IC3.13
N$28
  Top 0.508: IC2.8 22.86,93.98 22.86,66.04 IC1.9
  Bottom 0.508: IC1.9 24.13,64.77 10.16,64.77 7.62,62.23 LOOP1.2
  Bottom 0.61: IC2.8 26.67,95.25 35.56,95.25 R27.1
N$29
  Bottom 0.508: R21.2 43.18,43.18 D4.C
N$30  (via drill 0.35)
  Top 0.508: v17.78,76.2 Q5.1 17.78,87.63 16.51,88.9 Q6.2
  Bottom 0.508: R23.1 v17.78,76.2
  Bottom 0.61: R13.2 13.34,95.25 Q6.2
N$31
  Bottom 0.508: DN_CV1.1 6.99,22.86 8.26,21.59 22.23,21.59 23.5,22.86 34.92,22.86 36.2,21.59 43.18,21.59 R17.1
N$32  (via drill 0.35)
  Top 0.508: v43.18,19.05 43.18,24.13 R16.1
  Bottom 0.508: DPOT1.1 8.26,20.32 9.53,19.05 v43.18,19.05
N$33
  Bottom 0.508: R1.1 10.16,54.61 SEL1.2
N$34  (via drill 0.35)
  Top 0.508: v4.45,83.82 4.45,59.05 SEL1.1
  Bottom 0.508: v4.45,83.82 IC2.13
N$35  (via drill 0.35)
  Top 0.508: IC8.6 IC8.7 | R33.2 62.23,81.28 v59.69,83.82
  Bottom 0.508: R54.2 74.93,73.66 IC8.3 IC8.6 | IC8.7 R33.2 | v59.69,83.82 R51.2
N$36
  Bottom 0.508: INPUT1.1 R25.1
N$37
  Top 0.508: IC2.2 35.56,86.36 35.56,90.17 R30.1
  Bottom 0.61: IC2.10 IC2.5 R30.1
N$38  (via drill 0.35)
  Top 0.508: v5.71,64.77 v5.71,88.9 | Q6.3 v15.24,97.79
  Bottom 0.508: LOOP1.1 v5.71,64.77 | v5.71,88.9 13.97,88.9 Q6.3 | v15.24,97.79 R18.2
N$39  (via drill 0.35)
  Top 0.508: R8.1 R23.2 11.43,77.47 D7.C v12.7,87
  Bottom 0.508: v12.7,87 Q5.2
N$40  (via drill 0.35)
  Top 0.508: C23.2 v8.89,60.96 | R61.1 21.59,64.77 D5.C
  Bottom 0.508: IC1.10 24.13,60.96 R61.1 13.97,63.5 11.43,60.96 v8.89,60.96
N$41
  Top 0.508: R28.1 R29.1 36.83,87.63 D6.C
  Bottom 0.508: IC2.3 R29.1
N$43
  Bottom 0.508: IC5.5 D8.A
N$44
  Bottom 0.508: IC5.12 63.5,55.88 D9.C
N$45  (via drill 0.35)
  Top 0.508: R32.1 58.42,55.88 v58.42,71.12
  Bottom 0.508: IC5.4 IC5.13 60.96,53.34 R32.1 | v58.42,71.12 R33.1
N$46
  Top 0.508: IC8.2 IC8.1
  Bottom 0.508: IC8.1 R34.1
N$47  (via drill 0.35)
  Top 0.508: R31.1 v85.09,22.86 | R41.2 R36.2 R35.2
  Bottom 0.508: IC7.9 76.2,24.13 R41.2 80.01,22.86 v85.09,22.86
N$48
  Top 0.508: R37.3 77.47,19.05 R31.2
  Bottom 0.508: IC7.8 74.93,21.59 76.2,20.32 R31.2
N$49
  Top 0.508: R38.2 85.09,15.24 R37.1
N$50
  Top 0.508: R37.2 82.55,40.01 85.72,43.18 Q7.2
N$51  (via drill 0.35)
  Top 0.508: R39.1 v87.63,49.53
  Bottom 0.508: v87.63,49.53 Q7.3 82.55,49.53 Q8.3
N$52
  Bottom 0.508: C12.1 82.55,40.64 D10.A 77.47,40.64 IC7.14
N$53
  Top 0.508: R40.1 C12.2 81.28,39.37 81.28,40.64 83.82,43.18 Q7.1
  Bottom 0.508: IC7.13 76.2,34.29 R40.1
N$54
  Bottom 0.508: R36.1 90.17,30.48 UP_CV2.1
N$55  (via drill 0.35)
  Top 0.508: UPOT2.1 v96.52,33.02
  Bottom 0.508: R35.1 90.17,33.02 v96.52,33.02
N$56
  Bottom 0.508: OUT2.1 88.9,67.31 R34.2
N$57  (via drill 0.35)
  Top 0.508: R49.2 R44.2 R43.2 59.69,22.86 v59.69,20.32
  Bottom 0.508: IC7.6 65.41,24.13 64.14,25.4 R43.2 | v59.69,20.32 R42.1
N$58
  Top 0.508: R45.3 59.69,17.78 R42.2
  Bottom 0.508: IC7.7 64.77,21.59 63.5,20.32 R42.2
N$59
  Top 0.508: R46.2 54.61,15.24 R45.1
N$60
  Top 0.508: R45.2 57.15,19.05 58.42,20.32 58.42,23.5 56.52,25.4 56.52,43.81 53.98,46.35 Q9.2
N$61
  Bottom 0.508: Q10.3 57.15,46.99 Q9.3 R47.1
N$62
  Bottom 0.508: IC7.1 62.23,40.64 D11.A 57.15,40.64 C13.1
N$63
  Top 0.508: C13.2 57.78,40.01 57.78,47.62 Q9.1
  Bottom 0.508: IC7.2 63.5,34.29 R48.1 C13.2
N$64  (via drill 0.35)
  Top 0.508: v57.15,21.59 57.15,22.86 R44.1
  Bottom 0.508: DN_CV2.1 89.53,22.86 88.27,21.59 76.83,21.59 75.56,22.86 64.14,22.86 62.87,21.59 v57.15,21.59
N$65  (via drill 0.35)
  Top 0.508: v55.88,19.05 55.88,21.59 R43.1
  Bottom 0.508: DPOT2.1 95.25,19.05 v55.88,19.05
N$66
  Top 0.508: IC6.12 65.41,86.36 63.5,88.27 63.5,90.17 R53.1
  Bottom 0.508: IC6.12 66.67,86.36 67.94,87.63 71.75,87.63 73.03,88.9 IC6.4 | IC6.9 64.77,93.98 R53.1
N$67
  Top 0.508: IC5.8 76.2,66.04 76.2,92.08 74.3,93.98 IC6.6
  Bottom 0.508: LOOP2.2 91.44,62.23 88.9,64.77 74.93,64.77 IC5.8 | IC6.6 72.39,93.98 71.12,95.25 63.5,95.25 R50.1
N$68
  Bottom 0.508: R26.1 88.9,54.61 SEL2.2
N$69  (via drill 0.35)
  Top 0.508: v94.61,80.64 94.61,59.05 SEL2.1
  Bottom 0.508: v94.61,80.64 74.3,80.64 IC6.1
N$70
  Top 0.508: R51.1 R52.1 60.96,87.63 D13.C
  Bottom 0.508: IC6.11 64.77,88.9 R52.1
N$71
  Top 0.508: R58.2 C24.1
N$72
  Bottom 0.508: D11.C 55.88,43.18 R47.2
N$73
  Bottom 0.508: D10.C 85.09,40.64 82.55,43.18 R39.2
N$74  (via drill 0.35)
  Top 0.508: v83.82,73.66 83.82,74.93 83.19,75.56 83.19,77.47 81.28,79.38 Q11.1 81.28,85.72 Q12.2 | R55.2 v87.63,87
  Bottom 0.508: R57.1 v83.82,73.66 | v87.63,87 Q12.2
N$75  (via drill 0.35)
  Top 0.508: v93.34,64.77 v93.34,88.9 | R56.2 Q12.3
  Bottom 0.508: LOOP2.1 v93.34,64.77 | Q12.3 v93.34,88.9
N$76  (via drill 0.35)
  Top 0.508: R54.1 R57.2 87.63,77.47 D14.C v86.36,81.92
  Bottom 0.508: Q11.2 v86.36,81.92
N$77
  Bottom 0.508: INPUT2.1 R58.1
N$79
  Top 0.508: R25.2 C23.1
N$80  (via drill 0.35)
  Top 0.508: C24.2 v90.17,60.96 | R62.1 78.11,65.41 D12.C
  Bottom 0.508: v90.17,60.96 87.63,60.96 85.09,63.5 R62.1 75.56,60.96 IC5.7

### Text on the board
tPlace: matters | into | take | our | Aidan Taylor 2020 | Transients | Voltage Controlled / Function Generator | must | Gain / < > / Trim | own | We | hands | Up / Trim | Down / Trim | Down / Trim | Up / Trim
bPlace: Gate | Gate | Return | Return